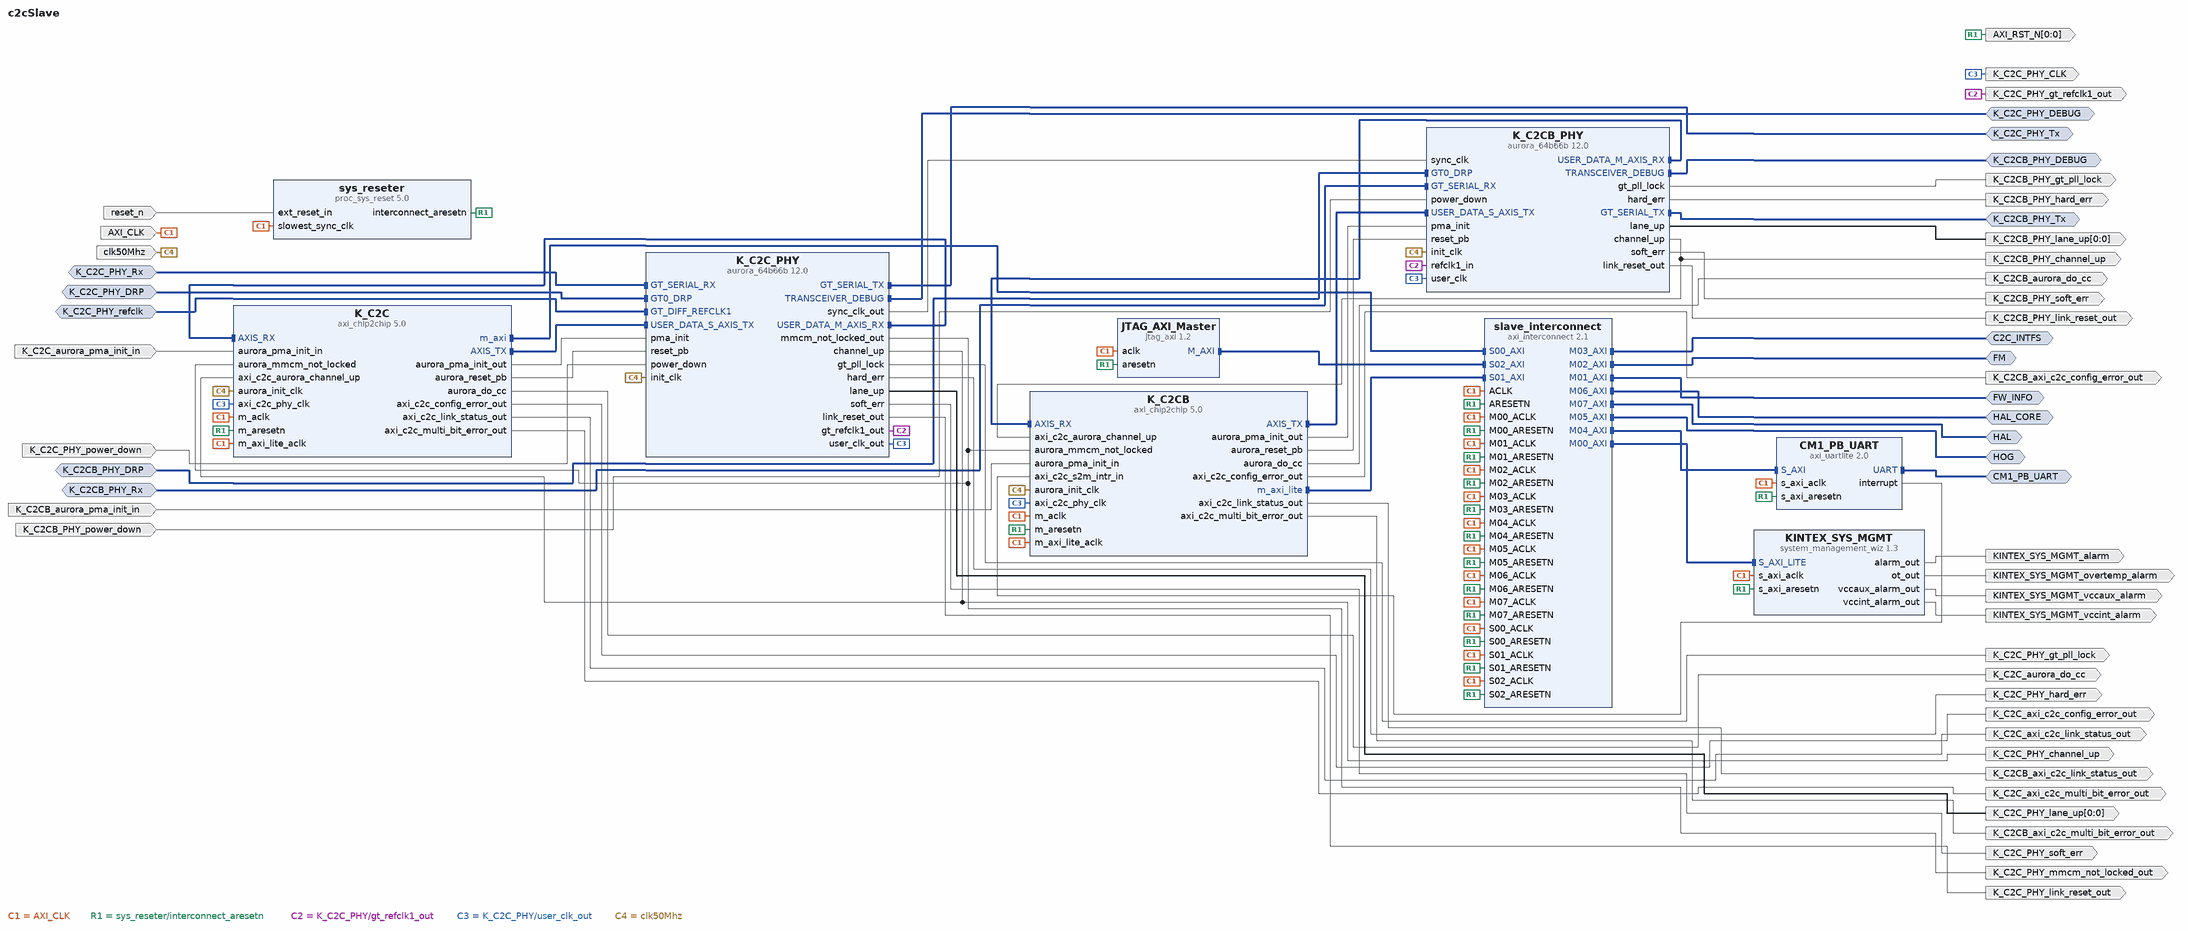
[diagram p0: block diagram of the top level]
# Vivado block design c2cSlave, xcku15p-ffva1760-2-e, Vivado 2020.2
create_bd_design c2cSlave

create_bd_intf_port -mode Slave -vlnv xilinx.com:interface:drp_rtl:1.0 K_C2C_PHY_DRP
create_bd_intf_port -mode Slave -vlnv xilinx.com:interface:diff_clock_rtl:1.0 K_C2C_PHY_refclk
set_property -dict {CONFIG.FREQ_HZ 200000000} [get_bd_intf_ports K_C2C_PHY_refclk]
create_bd_intf_port -mode Slave -vlnv xilinx.com:display_aurora:GT_Serial_Transceiver_Pins_RX_rtl:1.0 K_C2C_PHY_Rx
create_bd_intf_port -mode Master -vlnv xilinx.com:display_aurora:GT_Serial_Transceiver_Pins_TX_rtl:1.0 K_C2C_PHY_Tx
create_bd_intf_port -mode Master -vlnv xilinx.com:display_aurora:transceiver_debug_rtl:1.0 K_C2C_PHY_DEBUG
create_bd_intf_port -mode Slave -vlnv xilinx.com:interface:drp_rtl:1.0 K_C2CB_PHY_DRP
create_bd_intf_port -mode Slave -vlnv xilinx.com:display_aurora:GT_Serial_Transceiver_Pins_RX_rtl:1.0 K_C2CB_PHY_Rx
create_bd_intf_port -mode Master -vlnv xilinx.com:display_aurora:GT_Serial_Transceiver_Pins_TX_rtl:1.0 K_C2CB_PHY_Tx
create_bd_intf_port -mode Master -vlnv xilinx.com:display_aurora:transceiver_debug_rtl:1.0 K_C2CB_PHY_DEBUG
create_bd_intf_port -mode Master -vlnv xilinx.com:interface:aximm_rtl:1.0 FW_INFO
set_property -dict [list \
  CONFIG.ADDR_WIDTH 32 \
  CONFIG.DATA_WIDTH 32 \
  CONFIG.FREQ_HZ 50000000 \
  CONFIG.HAS_BURST 0 \
  CONFIG.HAS_CACHE 0 \
  CONFIG.HAS_LOCK 0 \
  CONFIG.HAS_QOS 0 \
  CONFIG.HAS_REGION 0 \
  CONFIG.PROTOCOL AXI4LITE \
] [get_bd_intf_ports FW_INFO]
create_bd_intf_port -mode Master -vlnv xilinx.com:interface:aximm_rtl:1.0 FM
set_property -dict [list \
  CONFIG.ADDR_WIDTH 32 \
  CONFIG.DATA_WIDTH 32 \
  CONFIG.FREQ_HZ 50000000 \
  CONFIG.HAS_BURST 0 \
  CONFIG.HAS_CACHE 0 \
  CONFIG.HAS_LOCK 0 \
  CONFIG.HAS_QOS 0 \
  CONFIG.HAS_REGION 0 \
  CONFIG.PROTOCOL AXI4LITE \
] [get_bd_intf_ports FM]
create_bd_intf_port -mode Master -vlnv xilinx.com:interface:aximm_rtl:1.0 C2C_INTFS
set_property -dict [list \
  CONFIG.ADDR_WIDTH 32 \
  CONFIG.DATA_WIDTH 32 \
  CONFIG.FREQ_HZ 50000000 \
  CONFIG.HAS_BURST 0 \
  CONFIG.HAS_CACHE 0 \
  CONFIG.HAS_LOCK 0 \
  CONFIG.HAS_QOS 0 \
  CONFIG.HAS_REGION 0 \
  CONFIG.PROTOCOL AXI4LITE \
] [get_bd_intf_ports C2C_INTFS]
create_bd_intf_port -mode Master -vlnv xilinx.com:interface:uart_rtl:1.0 CM1_PB_UART
create_bd_intf_port -mode Master -vlnv xilinx.com:interface:aximm_rtl:1.0 HOG
set_property -dict [list \
  CONFIG.ADDR_WIDTH 32 \
  CONFIG.DATA_WIDTH 32 \
  CONFIG.FREQ_HZ 50000000 \
  CONFIG.HAS_BURST 0 \
  CONFIG.HAS_CACHE 0 \
  CONFIG.HAS_LOCK 0 \
  CONFIG.HAS_QOS 0 \
  CONFIG.HAS_REGION 0 \
  CONFIG.PROTOCOL AXI4LITE \
] [get_bd_intf_ports HOG]
create_bd_intf_port -mode Master -vlnv xilinx.com:interface:aximm_rtl:1.0 HAL_CORE
set_property -dict [list \
  CONFIG.ADDR_WIDTH 32 \
  CONFIG.DATA_WIDTH 32 \
  CONFIG.FREQ_HZ 50000000 \
  CONFIG.HAS_BURST 0 \
  CONFIG.HAS_CACHE 0 \
  CONFIG.HAS_LOCK 0 \
  CONFIG.HAS_QOS 0 \
  CONFIG.HAS_REGION 0 \
  CONFIG.PROTOCOL AXI4LITE \
] [get_bd_intf_ports HAL_CORE]
create_bd_intf_port -mode Master -vlnv xilinx.com:interface:aximm_rtl:1.0 HAL
set_property -dict [list \
  CONFIG.ADDR_WIDTH 32 \
  CONFIG.DATA_WIDTH 32 \
  CONFIG.FREQ_HZ 50000000 \
  CONFIG.HAS_BURST 0 \
  CONFIG.HAS_CACHE 0 \
  CONFIG.HAS_LOCK 0 \
  CONFIG.HAS_QOS 0 \
  CONFIG.HAS_REGION 0 \
  CONFIG.PROTOCOL AXI4LITE \
] [get_bd_intf_ports HAL]
create_bd_port -dir I -type clk clk50Mhz
set_property -dict {CONFIG.FREQ_HZ 50000000} [get_bd_ports clk50Mhz]
create_bd_port -dir I -type rst reset_n
create_bd_port -dir I -type clk AXI_CLK
set_property -dict {CONFIG.ASSOCIATED_BUSIF HAL:FW_INFO:FM:C2C_INTFS:HOG:HAL_CORE CONFIG.FREQ_HZ 50000000} [get_bd_ports AXI_CLK]
create_bd_port -dir O -from 0 -to 0 -type rst AXI_RST_N
create_bd_port -dir I -type rst K_C2C_aurora_pma_init_in
set_property -dict {CONFIG.POLARITY ACTIVE_HIGH} [get_bd_ports K_C2C_aurora_pma_init_in]
create_bd_port -dir O K_C2C_aurora_do_cc
create_bd_port -dir O K_C2C_axi_c2c_config_error_out
create_bd_port -dir O K_C2C_axi_c2c_link_status_out
create_bd_port -dir O K_C2C_axi_c2c_multi_bit_error_out
create_bd_port -dir O -type clk K_C2C_PHY_gt_refclk1_out
set_property -dict {CONFIG.FREQ_HZ 200000000} [get_bd_ports K_C2C_PHY_gt_refclk1_out]
create_bd_port -dir I -type rst K_C2C_PHY_power_down
create_bd_port -dir O K_C2C_PHY_gt_pll_lock
create_bd_port -dir O K_C2C_PHY_hard_err
create_bd_port -dir O K_C2C_PHY_soft_err
create_bd_port -dir O -from 0 -to 0 K_C2C_PHY_lane_up
create_bd_port -dir O K_C2C_PHY_mmcm_not_locked_out
create_bd_port -dir O -type rst K_C2C_PHY_link_reset_out
create_bd_port -dir O K_C2C_PHY_channel_up
create_bd_port -dir O -type clk K_C2C_PHY_CLK
create_bd_port -dir I -type rst K_C2CB_aurora_pma_init_in
set_property -dict {CONFIG.POLARITY ACTIVE_HIGH} [get_bd_ports K_C2CB_aurora_pma_init_in]
create_bd_port -dir O K_C2CB_aurora_do_cc
create_bd_port -dir O K_C2CB_axi_c2c_config_error_out
create_bd_port -dir O K_C2CB_axi_c2c_link_status_out
create_bd_port -dir O K_C2CB_axi_c2c_multi_bit_error_out
create_bd_port -dir I -type rst K_C2CB_PHY_power_down
create_bd_port -dir O K_C2CB_PHY_gt_pll_lock
create_bd_port -dir O K_C2CB_PHY_hard_err
create_bd_port -dir O K_C2CB_PHY_soft_err
create_bd_port -dir O -from 0 -to 0 K_C2CB_PHY_lane_up
create_bd_port -dir O -type rst K_C2CB_PHY_link_reset_out
create_bd_port -dir O K_C2CB_PHY_channel_up
create_bd_port -dir O KINTEX_SYS_MGMT_alarm
create_bd_port -dir O KINTEX_SYS_MGMT_vccint_alarm
create_bd_port -dir O KINTEX_SYS_MGMT_vccaux_alarm
create_bd_port -dir O KINTEX_SYS_MGMT_overtemp_alarm

create_bd_cell -type ip -vlnv xilinx.com:ip:proc_sys_reset:5.0 sys_reseter
create_bd_cell -type ip -vlnv xilinx.com:ip:axi_chip2chip:5.0 K_C2C
set_property -dict [list \
  CONFIG.C_AXI_DATA_WIDTH 32 \
  CONFIG.C_AXI_STB_WIDTH 4 \
  CONFIG.C_EN_AXI_LINK_HNDLR false \
  CONFIG.C_INCLUDE_AXILITE 2 \
  CONFIG.C_INTERFACE_MODE 0 \
  CONFIG.C_INTERFACE_TYPE 2 \
  CONFIG.C_MASTER_FPGA 0 \
  CONFIG.C_M_AXI_ID_WIDTH 0 \
  CONFIG.C_M_AXI_WUSER_WIDTH 0 \
] [get_bd_cells K_C2C]
create_bd_cell -type ip -vlnv xilinx.com:ip:aurora_64b66b:12.0 K_C2C_PHY
set_property -dict [list \
  CONFIG.C_AURORA_LANES 1 \
  CONFIG.C_LINE_RATE 5 \
  CONFIG.C_REFCLK_FREQUENCY 200 \
  CONFIG.C_USE_CHIPSCOPE true \
  CONFIG.SINGLEEND_GTREFCLK False \
  CONFIG.SupportLevel 1 \
  CONFIG.TransceiverControl true \
  CONFIG.drp_mode Native \
  CONFIG.interface_mode Streaming \
] [get_bd_cells K_C2C_PHY]
create_bd_cell -type ip -vlnv xilinx.com:ip:axi_chip2chip:5.0 K_C2CB
set_property -dict [list \
  CONFIG.C_AXI_DATA_WIDTH 32 \
  CONFIG.C_AXI_STB_WIDTH 4 \
  CONFIG.C_EN_AXI_LINK_HNDLR false \
  CONFIG.C_INCLUDE_AXILITE 2 \
  CONFIG.C_INTERFACE_MODE 0 \
  CONFIG.C_INTERFACE_TYPE 2 \
  CONFIG.C_MASTER_FPGA 0 \
  CONFIG.C_M_AXI_ID_WIDTH 0 \
  CONFIG.C_M_AXI_WUSER_WIDTH 0 \
] [get_bd_cells K_C2CB]
create_bd_cell -type ip -vlnv xilinx.com:ip:aurora_64b66b:12.0 K_C2CB_PHY
set_property -dict [list \
  CONFIG.C_AURORA_LANES 1 \
  CONFIG.C_LINE_RATE 5 \
  CONFIG.C_REFCLK_FREQUENCY 200 \
  CONFIG.C_USE_CHIPSCOPE true \
  CONFIG.SupportLevel 0 \
  CONFIG.TransceiverControl true \
  CONFIG.drp_mode Native \
  CONFIG.interface_mode Streaming \
] [get_bd_cells K_C2CB_PHY]
create_bd_cell -type ip -vlnv xilinx.com:ip:jtag_axi:1.2 JTAG_AXI_Master
create_bd_cell -type ip -vlnv xilinx.com:ip:axi_interconnect:2.1 slave_interconnect
set_property -dict {CONFIG.NUM_MI 8 CONFIG.NUM_SI 3} [get_bd_cells slave_interconnect]
create_bd_cell -type ip -vlnv xilinx.com:ip:system_management_wiz:1.3 KINTEX_SYS_MGMT
set_property -dict {CONFIG.USER_TEMP_ALARM false} [get_bd_cells KINTEX_SYS_MGMT]
create_bd_cell -type ip -vlnv xilinx.com:ip:axi_uartlite:2.0 CM1_PB_UART
set_property -dict {CONFIG.C_BAUDRATE 115200} [get_bd_cells CM1_PB_UART]

# ---- connections ----

connect_bd_intf_net [get_bd_intf_pins K_C2C_PHY/USER_DATA_M_AXIS_RX] [get_bd_intf_pins K_C2C/AXIS_RX]
connect_bd_intf_net [get_bd_intf_pins K_C2C/AXIS_TX] [get_bd_intf_pins K_C2C_PHY/USER_DATA_S_AXIS_TX]
connect_bd_intf_net [get_bd_intf_ports HAL_CORE] [get_bd_intf_pins slave_interconnect/M06_AXI]
connect_bd_intf_net [get_bd_intf_ports K_C2CB_PHY_Tx] [get_bd_intf_pins K_C2CB_PHY/GT_SERIAL_TX]
connect_bd_intf_net [get_bd_intf_ports K_C2CB_PHY_DEBUG] [get_bd_intf_pins K_C2CB_PHY/TRANSCEIVER_DEBUG]
connect_bd_intf_net [get_bd_intf_ports K_C2C_PHY_Rx] [get_bd_intf_pins K_C2C_PHY/GT_SERIAL_RX]
connect_bd_intf_net [get_bd_intf_pins KINTEX_SYS_MGMT/S_AXI_LITE] [get_bd_intf_pins slave_interconnect/M00_AXI]
connect_bd_intf_net [get_bd_intf_ports K_C2C_PHY_Tx] [get_bd_intf_pins K_C2C_PHY/GT_SERIAL_TX]
connect_bd_intf_net [get_bd_intf_ports CM1_PB_UART] [get_bd_intf_pins CM1_PB_UART/UART]
connect_bd_intf_net [get_bd_intf_ports FW_INFO] [get_bd_intf_pins slave_interconnect/M01_AXI]
connect_bd_intf_net [get_bd_intf_ports K_C2CB_PHY_DRP] [get_bd_intf_pins K_C2CB_PHY/GT0_DRP]
connect_bd_intf_net [get_bd_intf_ports K_C2CB_PHY_Rx] [get_bd_intf_pins K_C2CB_PHY/GT_SERIAL_RX]
connect_bd_intf_net [get_bd_intf_pins K_C2CB/AXIS_TX] [get_bd_intf_pins K_C2CB_PHY/USER_DATA_S_AXIS_TX]
connect_bd_intf_net [get_bd_intf_pins K_C2CB_PHY/USER_DATA_M_AXIS_RX] [get_bd_intf_pins K_C2CB/AXIS_RX]
connect_bd_intf_net [get_bd_intf_ports FM] [get_bd_intf_pins slave_interconnect/M02_AXI]
connect_bd_intf_net [get_bd_intf_ports HAL] [get_bd_intf_pins slave_interconnect/M07_AXI]
connect_bd_intf_net [get_bd_intf_ports C2C_INTFS] [get_bd_intf_pins slave_interconnect/M03_AXI]
connect_bd_intf_net [get_bd_intf_pins CM1_PB_UART/S_AXI] [get_bd_intf_pins slave_interconnect/M04_AXI]
connect_bd_intf_net [get_bd_intf_ports HOG] [get_bd_intf_pins slave_interconnect/M05_AXI]
connect_bd_intf_net [get_bd_intf_pins K_C2C/m_axi] [get_bd_intf_pins slave_interconnect/S00_AXI]
connect_bd_intf_net [get_bd_intf_pins K_C2CB/m_axi_lite] [get_bd_intf_pins slave_interconnect/S01_AXI]
connect_bd_intf_net [get_bd_intf_pins JTAG_AXI_Master/M_AXI] [get_bd_intf_pins slave_interconnect/S02_AXI]
connect_bd_intf_net [get_bd_intf_ports K_C2C_PHY_DRP] [get_bd_intf_pins K_C2C_PHY/GT0_DRP]
connect_bd_intf_net [get_bd_intf_ports K_C2C_PHY_DEBUG] [get_bd_intf_pins K_C2C_PHY/TRANSCEIVER_DEBUG]
connect_bd_intf_net [get_bd_intf_ports K_C2C_PHY_refclk] [get_bd_intf_pins K_C2C_PHY/GT_DIFF_REFCLK1]
connect_bd_net [get_bd_ports reset_n] [get_bd_pins sys_reseter/ext_reset_in]
connect_bd_net [get_bd_ports AXI_CLK] \
  [get_bd_pins sys_reseter/slowest_sync_clk] [get_bd_pins K_C2C/m_aclk] [get_bd_pins K_C2C/m_axi_lite_aclk] \
  [get_bd_pins K_C2CB/m_aclk] [get_bd_pins K_C2CB/m_axi_lite_aclk] [get_bd_pins JTAG_AXI_Master/aclk] \
  [get_bd_pins slave_interconnect/ACLK] [get_bd_pins slave_interconnect/S00_ACLK] [get_bd_pins slave_interconnect/S01_ACLK] \
  [get_bd_pins slave_interconnect/S02_ACLK] [get_bd_pins slave_interconnect/M00_ACLK] \
  [get_bd_pins KINTEX_SYS_MGMT/s_axi_aclk] [get_bd_pins slave_interconnect/M01_ACLK] \
  [get_bd_pins slave_interconnect/M02_ACLK] [get_bd_pins slave_interconnect/M03_ACLK] \
  [get_bd_pins slave_interconnect/M04_ACLK] [get_bd_pins CM1_PB_UART/s_axi_aclk] [get_bd_pins slave_interconnect/M05_ACLK] \
  [get_bd_pins slave_interconnect/M06_ACLK] [get_bd_pins slave_interconnect/M07_ACLK]
connect_bd_net [get_bd_pins sys_reseter/interconnect_aresetn] \
  [get_bd_ports AXI_RST_N] [get_bd_pins K_C2C/m_aresetn] [get_bd_pins K_C2CB/m_aresetn] [get_bd_pins JTAG_AXI_Master/aresetn] \
  [get_bd_pins slave_interconnect/ARESETN] [get_bd_pins slave_interconnect/S00_ARESETN] \
  [get_bd_pins slave_interconnect/S01_ARESETN] [get_bd_pins slave_interconnect/S02_ARESETN] \
  [get_bd_pins slave_interconnect/M00_ARESETN] [get_bd_pins KINTEX_SYS_MGMT/s_axi_aresetn] \
  [get_bd_pins slave_interconnect/M01_ARESETN] [get_bd_pins slave_interconnect/M02_ARESETN] \
  [get_bd_pins slave_interconnect/M03_ARESETN] [get_bd_pins slave_interconnect/M04_ARESETN] \
  [get_bd_pins CM1_PB_UART/s_axi_aresetn] [get_bd_pins slave_interconnect/M05_ARESETN] \
  [get_bd_pins slave_interconnect/M06_ARESETN] [get_bd_pins slave_interconnect/M07_ARESETN]
connect_bd_net [get_bd_ports K_C2C_aurora_pma_init_in] [get_bd_pins K_C2C/aurora_pma_init_in]
connect_bd_net [get_bd_pins K_C2C/aurora_do_cc] [get_bd_ports K_C2C_aurora_do_cc]
connect_bd_net [get_bd_pins K_C2C/axi_c2c_config_error_out] [get_bd_ports K_C2C_axi_c2c_config_error_out]
connect_bd_net [get_bd_pins K_C2C/axi_c2c_link_status_out] [get_bd_ports K_C2C_axi_c2c_link_status_out]
connect_bd_net [get_bd_pins K_C2C/axi_c2c_multi_bit_error_out] [get_bd_ports K_C2C_axi_c2c_multi_bit_error_out]
connect_bd_net [get_bd_pins K_C2C_PHY/gt_refclk1_out] [get_bd_ports K_C2C_PHY_gt_refclk1_out] [get_bd_pins K_C2CB_PHY/refclk1_in]
connect_bd_net [get_bd_ports K_C2C_PHY_power_down] [get_bd_pins K_C2C_PHY/power_down]
connect_bd_net [get_bd_pins K_C2C_PHY/gt_pll_lock] [get_bd_ports K_C2C_PHY_gt_pll_lock]
connect_bd_net [get_bd_pins K_C2C_PHY/hard_err] [get_bd_ports K_C2C_PHY_hard_err]
connect_bd_net [get_bd_pins K_C2C_PHY/soft_err] [get_bd_ports K_C2C_PHY_soft_err]
connect_bd_net [get_bd_pins K_C2C_PHY/lane_up] [get_bd_ports K_C2C_PHY_lane_up]
connect_bd_net [get_bd_pins K_C2C_PHY/mmcm_not_locked_out] \
  [get_bd_ports K_C2C_PHY_mmcm_not_locked_out] [get_bd_pins K_C2C/aurora_mmcm_not_locked] \
  [get_bd_pins K_C2CB/aurora_mmcm_not_locked]
connect_bd_net [get_bd_pins K_C2C_PHY/link_reset_out] [get_bd_ports K_C2C_PHY_link_reset_out]
connect_bd_net [get_bd_pins K_C2C_PHY/channel_up] [get_bd_ports K_C2C_PHY_channel_up] [get_bd_pins K_C2C/axi_c2c_aurora_channel_up]
connect_bd_net [get_bd_pins K_C2C/aurora_pma_init_out] [get_bd_pins K_C2C_PHY/pma_init]
connect_bd_net [get_bd_pins K_C2C/aurora_reset_pb] [get_bd_pins K_C2C_PHY/reset_pb]
connect_bd_net [get_bd_pins K_C2C_PHY/user_clk_out] \
  [get_bd_pins K_C2C/axi_c2c_phy_clk] [get_bd_ports K_C2C_PHY_CLK] [get_bd_pins K_C2CB_PHY/user_clk] \
  [get_bd_pins K_C2CB/axi_c2c_phy_clk]
connect_bd_net [get_bd_ports clk50Mhz] \
  [get_bd_pins K_C2C_PHY/init_clk] [get_bd_pins K_C2C/aurora_init_clk] [get_bd_pins K_C2CB_PHY/init_clk] \
  [get_bd_pins K_C2CB/aurora_init_clk]
connect_bd_net [get_bd_ports K_C2CB_aurora_pma_init_in] [get_bd_pins K_C2CB/aurora_pma_init_in]
connect_bd_net [get_bd_pins K_C2CB/aurora_do_cc] [get_bd_ports K_C2CB_aurora_do_cc]
connect_bd_net [get_bd_pins K_C2CB/axi_c2c_config_error_out] [get_bd_ports K_C2CB_axi_c2c_config_error_out]
connect_bd_net [get_bd_pins K_C2CB/axi_c2c_link_status_out] [get_bd_ports K_C2CB_axi_c2c_link_status_out]
connect_bd_net [get_bd_pins K_C2CB/axi_c2c_multi_bit_error_out] [get_bd_ports K_C2CB_axi_c2c_multi_bit_error_out]
connect_bd_net [get_bd_ports K_C2CB_PHY_power_down] [get_bd_pins K_C2CB_PHY/power_down]
connect_bd_net [get_bd_pins K_C2CB_PHY/gt_pll_lock] [get_bd_ports K_C2CB_PHY_gt_pll_lock]
connect_bd_net [get_bd_pins K_C2CB_PHY/hard_err] [get_bd_ports K_C2CB_PHY_hard_err]
connect_bd_net [get_bd_pins K_C2CB_PHY/soft_err] [get_bd_ports K_C2CB_PHY_soft_err]
connect_bd_net [get_bd_pins K_C2CB_PHY/lane_up] [get_bd_ports K_C2CB_PHY_lane_up]
connect_bd_net [get_bd_pins K_C2CB_PHY/link_reset_out] [get_bd_ports K_C2CB_PHY_link_reset_out]
connect_bd_net [get_bd_pins K_C2CB_PHY/channel_up] [get_bd_ports K_C2CB_PHY_channel_up] [get_bd_pins K_C2CB/axi_c2c_aurora_channel_up]
connect_bd_net [get_bd_pins K_C2CB/aurora_pma_init_out] [get_bd_pins K_C2CB_PHY/pma_init]
connect_bd_net [get_bd_pins K_C2CB/aurora_reset_pb] [get_bd_pins K_C2CB_PHY/reset_pb]
connect_bd_net [get_bd_pins K_C2C_PHY/sync_clk_out] [get_bd_pins K_C2CB_PHY/sync_clk]
connect_bd_net [get_bd_pins KINTEX_SYS_MGMT/alarm_out] [get_bd_ports KINTEX_SYS_MGMT_alarm]
connect_bd_net [get_bd_pins KINTEX_SYS_MGMT/vccint_alarm_out] [get_bd_ports KINTEX_SYS_MGMT_vccint_alarm]
connect_bd_net [get_bd_pins KINTEX_SYS_MGMT/vccaux_alarm_out] [get_bd_ports KINTEX_SYS_MGMT_vccaux_alarm]
connect_bd_net [get_bd_pins KINTEX_SYS_MGMT/ot_out] [get_bd_ports KINTEX_SYS_MGMT_overtemp_alarm]
connect_bd_net [get_bd_pins CM1_PB_UART/interrupt] [get_bd_pins K_C2CB/axi_c2c_s2m_intr_in]

# ---- address map ----
assign_bd_address -offset 0x80000000 -range 16M -target_address_space [get_bd_addr_spaces JTAG_AXI_Master/Data] [get_bd_addr_segs FM/Reg]
assign_bd_address -offset 0x81001000 -range 4K -target_address_space [get_bd_addr_spaces JTAG_AXI_Master/Data] [get_bd_addr_segs KINTEX_SYS_MGMT/S_AXI_LITE/Reg]
assign_bd_address -offset 0x81003000 -range 4K -target_address_space [get_bd_addr_spaces JTAG_AXI_Master/Data] [get_bd_addr_segs FW_INFO/Reg]
assign_bd_address -offset 0x81004000 -range 4K -target_address_space [get_bd_addr_spaces JTAG_AXI_Master/Data] [get_bd_addr_segs HAL_CORE/Reg]
assign_bd_address -offset 0x81005000 -range 4K -target_address_space [get_bd_addr_spaces JTAG_AXI_Master/Data] [get_bd_addr_segs HAL/Reg]
assign_bd_address -offset 0x81008000 -range 4K -target_address_space [get_bd_addr_spaces JTAG_AXI_Master/Data] [get_bd_addr_segs CM1_PB_UART/S_AXI/Reg]
assign_bd_address -offset 0x81010000 -range 64K -target_address_space [get_bd_addr_spaces JTAG_AXI_Master/Data] [get_bd_addr_segs C2C_INTFS/Reg]
assign_bd_address -offset 0x81030000 -range 64K -target_address_space [get_bd_addr_spaces JTAG_AXI_Master/Data] [get_bd_addr_segs HOG/Reg]
assign_bd_address -offset 0x80000000 -range 16M -target_address_space [get_bd_addr_spaces K_C2C/MAXI] [get_bd_addr_segs FM/Reg]
assign_bd_address -offset 0x81001000 -range 4K -target_address_space [get_bd_addr_spaces K_C2C/MAXI] [get_bd_addr_segs KINTEX_SYS_MGMT/S_AXI_LITE/Reg]
assign_bd_address -offset 0x81003000 -range 4K -target_address_space [get_bd_addr_spaces K_C2C/MAXI] [get_bd_addr_segs FW_INFO/Reg]
assign_bd_address -offset 0x81004000 -range 4K -target_address_space [get_bd_addr_spaces K_C2C/MAXI] [get_bd_addr_segs HAL_CORE/Reg]
assign_bd_address -offset 0x81005000 -range 4K -target_address_space [get_bd_addr_spaces K_C2C/MAXI] [get_bd_addr_segs HAL/Reg]
assign_bd_address -offset 0x81008000 -range 4K -target_address_space [get_bd_addr_spaces K_C2C/MAXI] [get_bd_addr_segs CM1_PB_UART/S_AXI/Reg]
assign_bd_address -offset 0x81010000 -range 64K -target_address_space [get_bd_addr_spaces K_C2C/MAXI] [get_bd_addr_segs C2C_INTFS/Reg]
assign_bd_address -offset 0x81030000 -range 64K -target_address_space [get_bd_addr_spaces K_C2C/MAXI] [get_bd_addr_segs HOG/Reg]
assign_bd_address -offset 0x80000000 -range 16M -target_address_space [get_bd_addr_spaces K_C2CB/MAXI-Lite] [get_bd_addr_segs FM/Reg]
assign_bd_address -offset 0x81001000 -range 4K -target_address_space [get_bd_addr_spaces K_C2CB/MAXI-Lite] [get_bd_addr_segs KINTEX_SYS_MGMT/S_AXI_LITE/Reg]
assign_bd_address -offset 0x81003000 -range 4K -target_address_space [get_bd_addr_spaces K_C2CB/MAXI-Lite] [get_bd_addr_segs FW_INFO/Reg]
assign_bd_address -offset 0x81004000 -range 4K -target_address_space [get_bd_addr_spaces K_C2CB/MAXI-Lite] [get_bd_addr_segs HAL_CORE/Reg]
assign_bd_address -offset 0x81005000 -range 4K -target_address_space [get_bd_addr_spaces K_C2CB/MAXI-Lite] [get_bd_addr_segs HAL/Reg]
assign_bd_address -offset 0x81008000 -range 4K -target_address_space [get_bd_addr_spaces K_C2CB/MAXI-Lite] [get_bd_addr_segs CM1_PB_UART/S_AXI/Reg]
assign_bd_address -offset 0x81010000 -range 64K -target_address_space [get_bd_addr_spaces K_C2CB/MAXI-Lite] [get_bd_addr_segs C2C_INTFS/Reg]
assign_bd_address -offset 0x81030000 -range 64K -target_address_space [get_bd_addr_spaces K_C2CB/MAXI-Lite] [get_bd_addr_segs HOG/Reg]

validate_bd_design
save_bd_design
